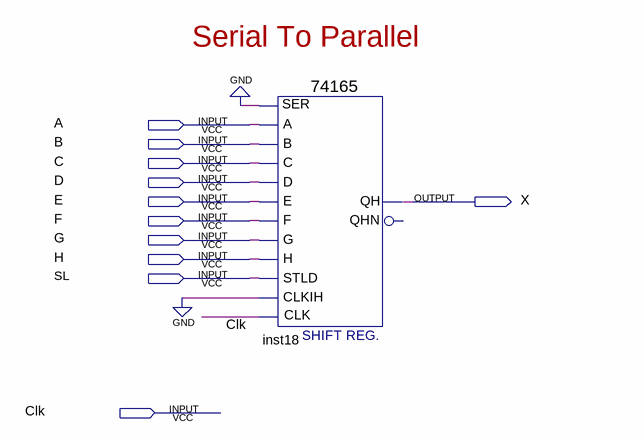
[diagram p0: schematic sheet]
// Quartus schematic ex165.bdf as structural Verilog: 1 symbols, 11 pins
module ex165 (
  input  A,
  input  B,
  input  C,
  input  D,
  input  E,
  input  F,
  input  G,
  input  H,
  input  SL,
  input  Clk,
  output X
);

  \74165  inst18 (
    .D(D), .C(C), .B(B), .G(G), .H(H), .A(A), .CLKIH(1'b0), .E(E), .F(F), .CLK(Clk), .STLD(SL), .SER(1'b0),
    .QH(X));  // open: QHN

  // Notes on the sheet:
  //   Serial To Parallel
endmodule
